# EAGLE design wings20 (EAGLE 5.01)
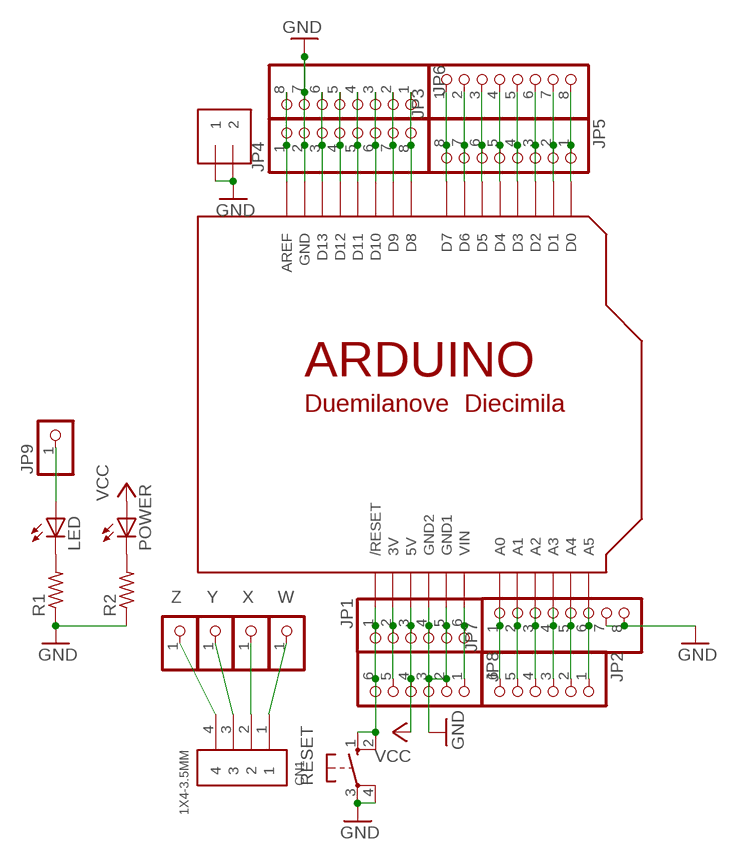
[diagram p0: schematic, sheet 1]

## Parts
CN1  1X4-3.5MM  [1X04-3.5MM]
J1  1X2-3.5MM  [1X2-3.5MM]
JP1  PINHD-1X6-3.5MM  [1X06-3.5MM]
JP2  PINHD-1X6CB  [1X06-CLEANBIG]
JP3  PINHD-1X8CLEANBIG  [1X08-CLEANBIG]
JP4  PINHD-1X8CLEANBIG  [1X08-CLEANBIG]
JP5  PINHD-1X8-3.5MM  [1X08-3.5MM]
JP6  PINHD-1X8-3.5MM  [1X08-3.5MM]
JP7  PINHD-1X8-3.5MM  [1X08-3.5MM]
JP8  PINHD-1X6CB  [1X06-CLEANBIG]
JP9  PINHD-1X1  [1X01]
LED  LED3MM  [LED3MM]
POWER  LED3MM  [LED3MM]
R1  R-US_0207/10  [0207/10]
R2  R-US_0207/10  [0207/10]
RESET  10-XX  [B3F-10XX]
U$1  ARDUINO-BPLACE  [ARDUINO-BPLACE]
W  PINHD-1X1  [1X01]
X  PINHD-1X1  [1X01]
Y  PINHD-1X1  [1X01]
Z  PINHD-1X1  [1X01]

## Nets
3V: JP1.2 JP8.5 U$1.3V
GND: J1.1 J1.2 JP1.4 JP1.5 JP4.2 JP6.7 JP7.7 JP7.8 JP8.2 JP8.3 R1.1 R2.1 RESET.3(P) RESET.4(P1) U$1.GND U$1.GND1 U$1.GND2
N$1: JP3.1 JP5.8 U$1.D7
N$2: JP3.2 JP5.7 U$1.D6
N$3: JP3.3 JP5.6 U$1.D5
N$4: JP3.4 JP5.5 U$1.D4
N$5: JP3.5 JP5.4 U$1.D3
N$6: JP3.6 JP5.3 U$1.D2
N$7: JP3.7 JP5.2 U$1.D1
N$8: JP3.8 JP5.1 U$1.D0
N$9: JP4.1 JP6.8 U$1.AREF
N$10: LED.K(C) R1.2
N$11: JP4.3 JP6.6 U$1.D13
N$12: JP4.4 JP6.5 U$1.D12
N$13: JP4.5 JP6.4 U$1.D11
N$14: JP4.6 JP6.3 U$1.D10
N$15: JP4.7 JP6.2 U$1.D9
N$16: JP4.8 JP6.1 U$1.D8
N$17: JP2.1 JP7.6 U$1.A5
N$18: JP2.2 JP7.5 U$1.A4
N$19: JP2.3 JP7.4 U$1.A3
N$20: JP2.4 JP7.3 U$1.A2
N$21: JP2.5 JP7.2 U$1.A1
N$22: JP2.6 JP7.1 U$1.A0
N$26: POWER.K(C) R2.2
N$27: JP9.1 LED.A
N$29: CN1.4 Z.1
N$30: JP1.1 JP8.6 RESET.1(S) RESET.2(S1) U$1.RESET(/RESET)
N$33: CN1.3 Y.1
N$34: CN1.2 X.1
N$35: CN1.1 W.1
VCC: JP1.3 JP8.4 POWER.A U$1.5V
VIN: JP1.6 JP8.1 U$1.VIN

## Library data of the parts
CN1 = adafruit:1X4: 4-pin connector
J1 = adafruit:1X2: 3.5mm Terminal block http://www.ladyada.net/library/pcb/eaglelibrary.html
JP1 JP2 JP8 = adafruit:PINHD-1X6: PIN HEADER
JP3-JP7 = adafruit:PINHD-1X8: PIN HEADER
JP9 W X Y Z = adafruit:PINHD-1X1: Pin header 1x1 for 0.1" spacing With round pins
LED POWER = adafruit:LED: LED OSRAM: - CHIPLED LG R971, LG N971, LY N971, LG Q971, LY Q971, LO R971, LY R971 LH N974, LH R974 LS Q976, LO Q976, LY Q976 LO Q996 - Hyper CHIPLED LW Q18S LB Q993, LB Q99A, LB R99A - SideLED LS A670, LO A670, LY A670, LG A670, LP A670 LB A673, LV A673, LT A673, LW A673 LH A674 LY A675 LS A676, LA A676, LO A676, LY A676, LW A676 LS A679, LY A679, LG A679 - Hyper Micro SIDELED® LS Y876, LA Y876, LO Y876, LY Y876 LT Y87S - SmartLED LW L88C, LW L88S LB L89C, LB L89S, LG L890 LS L89K, LO L89K, LY L89K LS L896, LA L896, LO L896, LY L896 - TOPLED LS T670, LO T670, LY T670, LG T670, LP T670 LSG T670, LSP T670, LSY T670, LOP T670, LYG T670 LG T671, LOG T671, LSG T671 LB T673, LV T673, LT T673, LW T673 LH T674 LS T676, LA T676, LO T676, LY T676, LB T676, LH T676, LSB T676, LW T676 LB T67C, LV T67C, LT T67C, LS T67K, LO T67K, LY T67K, LW E67C LS E67B, LA E67B, LO E67B, LY E67B, LB E67C, LV E67C, LT E67C LW T67C LS T679, LY T679, LG T679 LS T770, LO T770, LY T770, LG T770, LP T770 LB T773, LV T773, LT T773, LW T773 LH T774 LS E675, LA E675, LY E675, LS T675 LS T776, LA T776, LO T776, LY T776, LB T776 LHGB T686 LT T68C, LB T68C - Hyper Mini TOPLED® LB M676 - Mini TOPLED Santana® LG M470 LS M47K, LO M47K, LY M47K Source: http://www.osram.convergy.de/
R1 R2 = adafruit:R-US_: RESISTOR, American symbol
RESET = switch-omron:10-XX: OMRON SWITCH
U$1 = adafruit:ARDUINO: Arduino Diecimila/Duemilanove Make a shield with ease, this package has all the named pins as well as the two mounting drill holes and an outline of the USB and DC power connector. The outline is on the DIMENSION layer, so if your board house uses it they will cut the outline to match. http://www.ladyada.net/library/pcb/eaglelibrary.html

## Board
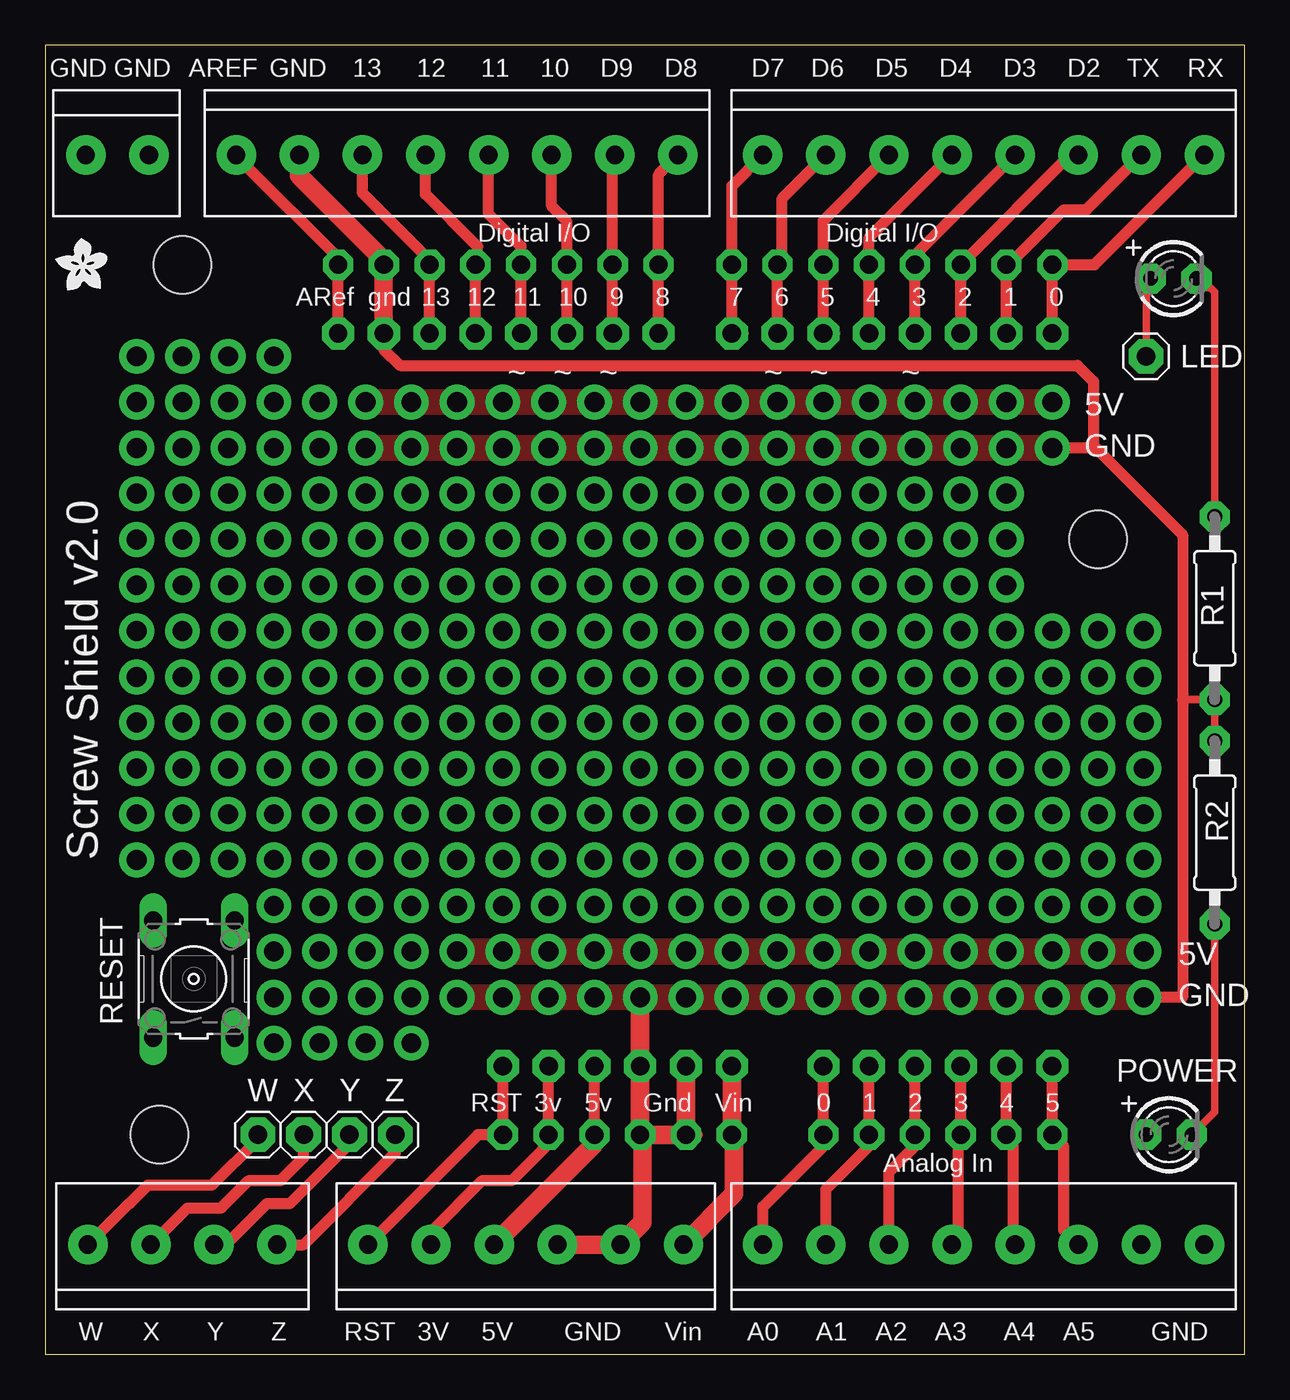
[diagram p1: board, top side]
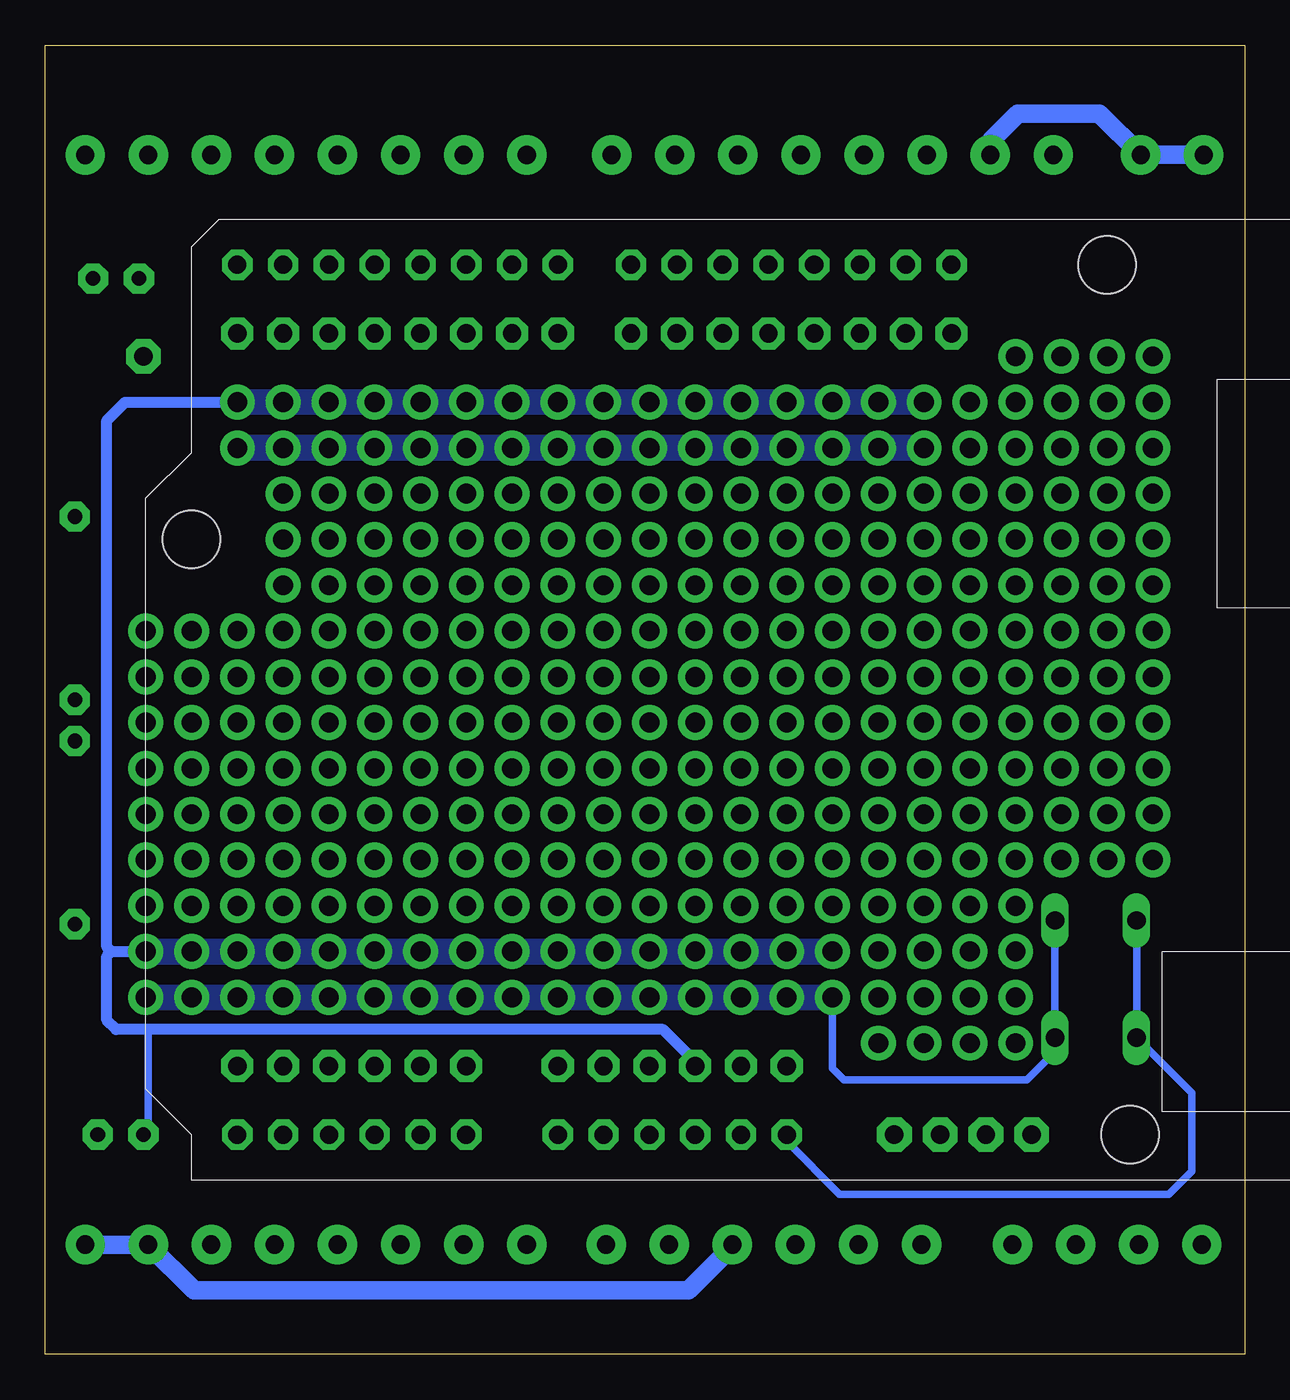
[diagram p2: board, bottom side, seen from below]

Size 66.55 x 72.64 mm. Coordinates in mm from the lower left corner, seen from the top.
Outline: 0,0 66.55,0 66.55,72.64 0,72.64 0,0
Copper layers (1*16): Top 0.035mm / dielectric 1.5mm / Bottom 0.035mm
Design rules "default *": minimum track width 16mil, minimum drill 24mil, track to track 12mil, track to pad 12mil, pad to pad 12mil, via to via 12mil, smd to smd 12mil, copper to edge 20mil, drill to drill 8mil, minimum pad ring 10mil, minimum via ring 8mil, stop-mask expansion 4mil, vias tented up to drill 0mil, thermal gap 10mil

### Footprints (pad centres in the part's own frame; a part is rotated, then mirrored left to right if it is on the bottom)
1X04-3.5MM = drill 1 pad 2.184 round: 1 -5.25,0; 2 -1.75,0; 3 1.75,0; 4 5.25,0
1X2-3.5MM = drill 1 pad 2.184 round: 1 1.8,0; 2 -1.7,0
1X06-3.5MM = drill 1 pad 2.184 round: 1 -8.75,0; 2 -5.25,0; 3 -1.75,0; 4 1.75,0; 5 5.25,0; 6 8.75,0
1X06-CLEANBIG = drill 1.016 pad 1.778 octagon: 1 -6.35,0; 2 -3.81,0; 3 -1.27,0; 4 1.27,0; 5 3.81,0; 6 6.35,0
1X08-CLEANBIG = drill 1.016 pad 1.778 octagon: 1 -8.89,0; 2 -6.35,0; 3 -3.81,0; 4 -1.27,0; 5 1.27,0; 6 3.81,0; 7 6.35,0; 8 8.89,0
1X08-3.5MM = drill 1 pad 2.184 round: 1 -12.25,0; 2 -8.75,0; 3 -5.25,0; 4 -1.75,0; 5 1.75,0; 6 5.25,0; 7 8.75,0; 8 12.25,0
1X01 = drill 1.016 pad 1.93 octagon: 1 0,0
LED3MM = drill 0.813 pad 1.676 octagon: A -1.27,0; K 1.27,0
0207/10 = drill 0.813 pad 1.676 octagon: 1 -5.08,0; 2 5.08,0
B3F-10XX = drill 1.016 long: 1 -3.251,2.261; 2 3.251,2.261; 3 -3.251,-2.261; 4 3.251,-2.261
ARDUINO-BPLACE = drill 1 pad 1.676 octagon: 3V 35.56,2.54; 5V 38.1,2.54; A0 50.8,2.54; A1 53.34,2.54; A2 55.88,2.54; A3 58.42,2.54; A4 60.96,2.54; A5 63.5,2.54; AREF 23.876,50.8; D0 63.5,50.8; D1 60.96,50.8; D2 58.42,50.8; D3 55.88,50.8; D4 53.34,50.8; D5 50.8,50.8; D6 48.26,50.8; D7 45.72,50.8; D8 41.656,50.8; D9 39.116,50.8; D10 36.576,50.8; D11 34.036,50.8; D12 31.496,50.8; D13 28.956,50.8; GND 26.416,50.8; GND1 43.18,2.54; GND2 40.64,2.54; RESET 33.02,2.54; VIN 45.72,2.54 | hole 3.2: 15.24,50.8; 66.04,35.56; 13.97,2.54

### Placement (x,y rotation side)
CN1  7.62,6.1 0 top
J1  4.06,66.55 180 top
JP1  26.67,6.1 0 top
JP2  49.53,16 180 top
JP3  46.99,56.64 0 top
JP4  25.15,56.64 0 top
JP5  52.07,66.55 180 top
JP6  22.86,66.55 180 top
JP7  52.07,6.1 0 top
JP8  31.75,16 180 top
JP9  61.09,55.37 0 top
LED  62.61,59.69 0 top
POWER  62.36,12.19 0 top
R1  64.9,41.4 90 top
R2  64.9,28.96 270 top
RESET  8.25,20.83 90 top
U$1  -7.62,9.65 0 top
U$2  [ADAFRUIT200MIL]  1.91,60.45 0 top
W  11.81,12.19 0 top
X  14.35,12.19 0 top
Y  16.89,12.19 0 top
Z  19.43,12.19 0 top

### Tracks (layer width: path | path; a pad name or v marks a point on that pad's centre or on a via)
3V
  Top 0.61: 21.46,6.05 21.46,5.84 | JP1.2 21.46,6.05 | 21.46,6.05 21.46,6.86 24.26,9.65 25.91,9.65 27.94,11.68 U$1.3V JP8.5
GND  (via drill 1.1 pad 1.93)
  Top 0.406: R2.1 R1.1 63.12,36.32
  Top 0.61: 33.15,12.19 U$1.GND2 | v35.56,19.81 35.81,19.81 | v60.96,19.81 63.12,19.81 63.12,36.32 63.12,45.47 58.29,50.29 58.17,50.29 | U$1.GND1 36.2,12.19 | JP6.7 14.1,66.55 | 31.92,5.84 31.88,5.84 | JP1.5 31.92,5.84 | 31.92,5.84 32.13,5.84 | JP4.2 18.8,55.75 19.68,54.86 57.28,54.86 58.17,53.98 58.17,50.29 | 58.17,50.29 v55.88,50.29
  Top 1.016: JP1.4 JP1.5 33.15,7.32 33.15,12.19 U$1.GND1 JP8.2 | U$1.GND2 JP8.3 v33.02,19.81 | JP6.7 14.11,65.39 18.8,60.71 U$1.GND JP4.2
  Bottom 0.406: 22.61,19.81 v22.86,19.81 22.86,15.88 22.22,15.24 12.06,15.24 10.52,16.79 RESET.3 10.52,23.6 10.67,23.75 10.67,23.93 RESET.4
  Bottom 0.61: J1.2 5.76,66.34 5.72,66.29 5.46,66.55
  Bottom 1.016: J1.1 5.46,66.55 | J1.2 8.05,68.83 12.57,68.83 14.1,67.31 14.1,66.56 JP6.7 | 64.39,6.1 JP7.8 JP7.7 58.28,3.56 30.86,3.56 28.57,5.84 28.57,5.94 JP1.4
  other vias: 17.78,50.29 20.32,50.29 22.86,50.29 25.4,50.29 27.94,50.29 30.48,50.29 33.02,50.29 35.56,50.29 38.1,50.29 40.64,50.29 43.18,50.29 45.72,50.29 48.26,50.29 50.8,50.29 53.34,50.29 25.4,19.81 27.94,19.81 30.48,19.81 38.1,19.81 40.64,19.81 43.18,19.81 45.72,19.81 48.26,19.81 50.8,19.81 53.34,19.81 55.88,19.81 58.42,19.81
  pour Top: 17.78,50.8 56.39,50.8 56.39,49.78 17.78,49.78
  pour Bottom: 56.13,50.8 17.78,50.8 17.78,49.78 56.13,49.78
  pour Bottom: 61.21,20.32 22.86,20.32 22.86,19.3 61.21,19.3
  pour Top: 22.86,20.32 61.47,20.32 61.47,19.3 22.86,19.3
N$1
  Top 0.61: 38.73,56.64 JP3.1 U$1.D7 38.1,64.83 JP5.8
N$2
  Top 0.61: JP5.7 40.89,64.12 40.89,60.71 U$1.D6 JP3.2
N$3
  Top 0.61: 43.82,56.64 JP3.3 U$1.D5 43.18,62.91 JP5.6
N$4
  Top 0.61: JP3.4 U$1.D4 45.72,61.95 JP5.5
N$5
  Top 0.61: JP3.5 U$1.D3 48.26,60.99 JP5.4
N$6
  Top 0.61: 51.18,60.2 51.18,60.41 50.72,60.41 50.67,60.45 U$1.D2 | JP3.6 U$1.D2 | U$1.D2 50.67,60.33 | JP5.3 56.9,66.55 U$1.D2
N$7
  Top 0.61: JP5.2 57.77,63.5 56.52,63.5 53.47,60.45 | JP3.7 U$1.D1 53.47,60.45 | 53.47,60.45 53.72,60.2
N$8
  Top 0.61: JP5.1 58.22,60.45 U$1.D0 JP3.8
N$9
  Top 0.61: JP6.8 10.61,66.48 16.64,60.45 U$1.AREF JP4.1
N$10
  Top 0.406: LED.K 64.39,59.18 64.64,59.18 64.9,58.93 R1.2
N$11
  Top 0.61: JP4.3 U$1.D13 21.34,60.71 17.61,64.43 JP6.6
N$12
  Top 0.61: JP6.5 21.11,64.36 24,61.47 24,60.45 U$1.D12 JP4.4
N$13
  Top 0.61: JP4.5 U$1.D11 26.42,61.47 24.61,63.27 JP6.4
N$14
  Top 0.61: JP6.3 28.11,63.71 28.96,62.87 U$1.D10 JP4.6
N$15
  Top 0.61: JP4.7 U$1.D9 31.5,66.43 JP6.2
N$16
  Top 0.61: JP4.8 U$1.D8 34.04,65.47 JP6.1
N$17
  Top 0.61: JP7.6 56.52,6.9 56.52,11.56 U$1.A5 JP2.1
N$18
  Top 0.61: JP7.5 53.72,6 53.72,11.81 U$1.A4 JP2.2
N$19
  Top 0.61: JP7.4 50.67,6.45 50.67,12.06 U$1.A3 JP2.3
N$20
  Top 0.61: JP7.3 46.82,10.12 48.26,11.56 U$1.A2 JP2.4
N$21
  Top 0.61: JP7.2 43.32,9.16 45.72,11.56 U$1.A1 JP2.5
N$22
  Top 0.61: JP7.1 39.82,8.2 43.18,11.56 U$1.A0 JP2.6
N$23  (via drill 1.1 pad 1.93)
  other vias: 15.24,52.83
N$24  (via drill 1.1 pad 1.93)
  other vias: 12.7,55.37
N$26
  Top 0.406: POWER.K 64.9,13.46 R2.2
N$27
  Top 0.406: LED.A 61.09,59.44 JP9.1
N$28  (via drill 1.1 pad 1.93)
  other vias: 10.16,55.37
N$29
  Top 0.61: CN1.4 14.35,6.1 19.43,11.18 Z.1 19.68,12.45
N$30
  Top 0.61: JP8.6 U$1.RESET 24.02,12.19 JP1.1
  Bottom 0.406: RESET.2 5.97,24.05 5.97,17.55 RESET.1 2.92,14.5 2.92,10.16 4.19,8.89 22.48,8.89 25.4,11.81 U$1.RESET 25.78,12.19
N$31  (via drill 1.1 pad 1.93)
  other vias: 7.62,55.37
N$32  (via drill 1.1 pad 1.93)
  other vias: 5.08,55.37
N$33
  Top 0.61: CN1.3 10.03,6.1 12.32,8.38 13.59,8.38 16.89,11.68 Y.1
N$34
  Top 0.61: CN1.2 7.9,8.13 9.78,8.13 11.3,9.65 13.08,9.65 14.35,10.92 X.1
N$35
  Top 0.61: CN1.1 4.66,8.38 4.7,8.38 5.72,9.4 9.27,9.4 11.81,11.94 W.1
N$46  (via drill 1.1 pad 1.93)
  other vias: 15.24,50.29
N$49  (via drill 1.1 pad 1.93)
  other vias: 17.78,47.75
N$50  (via drill 1.1 pad 1.93)
  other vias: 15.24,47.75
N$51  (via drill 1.1 pad 1.93)
  other vias: 20.32,47.75
N$52  (via drill 1.1 pad 1.93)
  other vias: 22.86,47.75
N$55  (via drill 1.1 pad 1.93)
  other vias: 25.4,47.75
N$56  (via drill 1.1 pad 1.93)
  other vias: 27.94,47.75
N$59  (via drill 1.1 pad 1.93)
  other vias: 30.48,47.75
N$60  (via drill 1.1 pad 1.93)
  other vias: 33.02,47.75
N$63  (via drill 1.1 pad 1.93)
  other vias: 35.56,47.75
N$64  (via drill 1.1 pad 1.93)
  other vias: 38.1,47.75
N$67  (via drill 1.1 pad 1.93)
  other vias: 40.64,47.75
N$68  (via drill 1.1 pad 1.93)
  other vias: 43.18,47.75
N$71  (via drill 1.1 pad 1.93)
  other vias: 48.26,47.75
N$73  (via drill 1.1 pad 1.93)
  other vias: 45.72,47.75
N$74  (via drill 1.1 pad 1.93)
  other vias: 50.8,47.75
N$77  (via drill 1.1 pad 1.93)
  other vias: 53.34,47.75
N$82  (via drill 1.1 pad 1.93)
  other vias: 55.88,40.13
N$83  (via drill 1.1 pad 1.93)
  other vias: 55.88,37.59
N$84  (via drill 1.1 pad 1.93)
  other vias: 55.88,35.05
N$85  (via drill 1.1 pad 1.93)
  other vias: 55.88,32.51
N$86  (via drill 1.1 pad 1.93)
  other vias: 55.88,29.97
N$87  (via drill 1.1 pad 1.93)
  other vias: 55.88,27.43
N$88  (via drill 1.1 pad 1.93)
  other vias: 55.88,24.89
N$91  (via drill 1.1 pad 1.93)
  other vias: 12.7,52.83
N$92  (via drill 1.1 pad 1.93)
  other vias: 12.7,47.75
N$93  (via drill 1.1 pad 1.93)
  other vias: 53.34,24.89
N$94  (via drill 1.1 pad 1.93)
  other vias: 53.34,27.43
N$95  (via drill 1.1 pad 1.93)
  other vias: 53.34,29.97
N$96  (via drill 1.1 pad 1.93)
  other vias: 53.34,32.51
N$97  (via drill 1.1 pad 1.93)
  other vias: 53.34,35.05
N$98  (via drill 1.1 pad 1.93)
  other vias: 53.34,37.59
N$99  (via drill 1.1 pad 1.93)
  other vias: 53.34,40.13
N$100  (via drill 1.1 pad 1.93)
  other vias: 53.34,42.67
N$101  (via drill 1.1 pad 1.93)
  other vias: 53.34,45.21
N$102  (via drill 1.1 pad 1.93)
  other vias: 50.8,45.21
N$103  (via drill 1.1 pad 1.93)
  other vias: 50.8,42.67
N$104  (via drill 1.1 pad 1.93)
  other vias: 50.8,40.13
N$105  (via drill 1.1 pad 1.93)
  other vias: 50.8,35.05
N$106  (via drill 1.1 pad 1.93)
  other vias: 50.8,37.59
N$107  (via drill 1.1 pad 1.93)
  other vias: 50.8,32.51
N$108  (via drill 1.1 pad 1.93)
  other vias: 50.8,29.97
N$109  (via drill 1.1 pad 1.93)
  other vias: 50.8,27.43
N$110  (via drill 1.1 pad 1.93)
  other vias: 50.8,24.89
N$113  (via drill 1.1 pad 1.93)
  other vias: 45.72,24.89
N$114  (via drill 1.1 pad 1.93)
  other vias: 48.26,24.89
N$115  (via drill 1.1 pad 1.93)
  other vias: 48.26,27.43
N$116  (via drill 1.1 pad 1.93)
  other vias: 45.72,27.43
N$117  (via drill 1.1 pad 1.93)
  other vias: 45.72,29.97
N$118  (via drill 1.1 pad 1.93)
  other vias: 48.26,29.97
N$119  (via drill 1.1 pad 1.93)
  other vias: 48.26,32.51
N$120  (via drill 1.1 pad 1.93)
  other vias: 45.72,32.51
N$121  (via drill 1.1 pad 1.93)
  other vias: 45.72,35.05
N$122  (via drill 1.1 pad 1.93)
  other vias: 48.26,35.05
N$123  (via drill 1.1 pad 1.93)
  other vias: 48.26,37.59
N$124  (via drill 1.1 pad 1.93)
  other vias: 45.72,37.59
N$125  (via drill 1.1 pad 1.93)
  other vias: 45.72,40.13
N$126  (via drill 1.1 pad 1.93)
  other vias: 48.26,40.13
N$127  (via drill 1.1 pad 1.93)
  other vias: 48.26,42.67
N$128  (via drill 1.1 pad 1.93)
  other vias: 45.72,42.67
N$129  (via drill 1.1 pad 1.93)
  other vias: 45.72,45.21
N$130  (via drill 1.1 pad 1.93)
  other vias: 48.26,45.21
N$131  (via drill 1.1 pad 1.93)
  other vias: 43.18,45.21
N$132  (via drill 1.1 pad 1.93)
  other vias: 43.18,40.13
N$133  (via drill 1.1 pad 1.93)
  other vias: 43.18,42.67
N$134  (via drill 1.1 pad 1.93)
  other vias: 43.18,37.59
N$135  (via drill 1.1 pad 1.93)
  other vias: 43.18,35.05
N$136  (via drill 1.1 pad 1.93)
  other vias: 43.18,32.51
N$137  (via drill 1.1 pad 1.93)
  other vias: 43.18,29.97
N$138  (via drill 1.1 pad 1.93)
  other vias: 43.18,27.43
N$139  (via drill 1.1 pad 1.93)
  other vias: 43.18,24.89
N$142  (via drill 1.1 pad 1.93)
  other vias: 40.64,42.67
N$143  (via drill 1.1 pad 1.93)
  other vias: 40.64,45.21
N$144  (via drill 1.1 pad 1.93)
  other vias: 40.64,40.13
N$145  (via drill 1.1 pad 1.93)
  other vias: 40.64,37.59
N$146  (via drill 1.1 pad 1.93)
  other vias: 40.64,35.05
N$147  (via drill 1.1 pad 1.93)
  other vias: 40.64,32.51
N$148  (via drill 1.1 pad 1.93)
  other vias: 40.64,29.97
N$149  (via drill 1.1 pad 1.93)
  other vias: 40.64,27.43
N$150  (via drill 1.1 pad 1.93)
  other vias: 40.64,24.89
N$153  (via drill 1.1 pad 1.93)
  other vias: 38.1,24.89
N$154  (via drill 1.1 pad 1.93)
  other vias: 38.1,27.43
N$155  (via drill 1.1 pad 1.93)
  other vias: 38.1,29.97
N$156  (via drill 1.1 pad 1.93)
  other vias: 38.1,32.51
N$157  (via drill 1.1 pad 1.93)
  other vias: 38.1,35.05
N$158  (via drill 1.1 pad 1.93)
  other vias: 38.1,37.59
N$159  (via drill 1.1 pad 1.93)
  other vias: 38.1,40.13
N$160  (via drill 1.1 pad 1.93)
  other vias: 38.1,42.67
N$161  (via drill 1.1 pad 1.93)
  other vias: 38.1,45.21
N$162  (via drill 1.1 pad 1.93)
  other vias: 35.56,45.21
N$163  (via drill 1.1 pad 1.93)
  other vias: 35.56,42.67
N$164  (via drill 1.1 pad 1.93)
  other vias: 35.56,40.13
N$165  (via drill 1.1 pad 1.93)
  other vias: 35.56,37.59
N$166  (via drill 1.1 pad 1.93)
  other vias: 35.56,35.05
N$167  (via drill 1.1 pad 1.93)
  other vias: 35.56,32.51
N$168  (via drill 1.1 pad 1.93)
  other vias: 35.56,29.97
N$169  (via drill 1.1 pad 1.93)
  other vias: 35.56,27.43
N$170  (via drill 1.1 pad 1.93)
  other vias: 35.56,24.89
N$173  (via drill 1.1 pad 1.93)
  other vias: 30.48,24.89
N$174  (via drill 1.1 pad 1.93)
  other vias: 33.02,24.89
N$175  (via drill 1.1 pad 1.93)
  other vias: 33.02,27.43
N$176  (via drill 1.1 pad 1.93)
  other vias: 30.48,27.43
N$177  (via drill 1.1 pad 1.93)
  other vias: 30.48,29.97
N$178  (via drill 1.1 pad 1.93)
  other vias: 33.02,29.97
N$179  (via drill 1.1 pad 1.93)
  other vias: 33.02,32.51
N$180  (via drill 1.1 pad 1.93)
  other vias: 30.48,35.05
N$181  (via drill 1.1 pad 1.93)
  other vias: 30.48,37.59
N$182  (via drill 1.1 pad 1.93)
  other vias: 33.02,40.13
N$183  (via drill 1.1 pad 1.93)
  other vias: 30.48,40.13
N$184  (via drill 1.1 pad 1.93)
  other vias: 30.48,42.67
N$185  (via drill 1.1 pad 1.93)
  other vias: 33.02,45.21
N$186  (via drill 1.1 pad 1.93)
  other vias: 30.48,45.21
N$187  (via drill 1.1 pad 1.93)
  other vias: 33.02,42.67
N$188  (via drill 1.1 pad 1.93)
  other vias: 33.02,37.59
N$189  (via drill 1.1 pad 1.93)
  other vias: 30.48,32.51
N$190  (via drill 1.1 pad 1.93)
  other vias: 33.02,35.05
N$193  (via drill 1.1 pad 1.93)
  other vias: 27.94,24.89
N$194  (via drill 1.1 pad 1.93)
  other vias: 27.94,27.43
N$195  (via drill 1.1 pad 1.93)
  other vias: 27.94,45.21
N$196  (via drill 1.1 pad 1.93)
  other vias: 27.94,42.67
N$197  (via drill 1.1 pad 1.93)
  other vias: 27.94,40.13
N$198  (via drill 1.1 pad 1.93)
  other vias: 27.94,37.59
N$199  (via drill 1.1 pad 1.93)
  other vias: 27.94,35.05
N$200  (via drill 1.1 pad 1.93)
  other vias: 27.94,29.97
N$201  (via drill 1.1 pad 1.93)
  other vias: 27.94,32.51
N$202  (via drill 1.1 pad 1.93)
  other vias: 25.4,32.51
N$203  (via drill 1.1 pad 1.93)
  other vias: 25.4,45.21
N$204  (via drill 1.1 pad 1.93)
  other vias: 25.4,40.13
N$205  (via drill 1.1 pad 1.93)
  other vias: 25.4,42.67
N$206  (via drill 1.1 pad 1.93)
  other vias: 25.4,37.59
N$207  (via drill 1.1 pad 1.93)
  other vias: 25.4,35.05
N$208  (via drill 1.1 pad 1.93)
  other vias: 25.4,29.97
N$209  (via drill 1.1 pad 1.93)
  other vias: 25.4,27.43
N$210  (via drill 1.1 pad 1.93)
  other vias: 25.4,24.89
N$213  (via drill 1.1 pad 1.93)
  other vias: 22.86,24.89
N$214  (via drill 1.1 pad 1.93)
  other vias: 22.86,27.43
N$215  (via drill 1.1 pad 1.93)
  other vias: 22.86,29.97
N$216  (via drill 1.1 pad 1.93)
  other vias: 22.86,32.51
N$217  (via drill 1.1 pad 1.93)
  other vias: 22.86,37.59
N$218  (via drill 1.1 pad 1.93)
  other vias: 22.86,40.13
N$219  (via drill 1.1 pad 1.93)
  other vias: 22.86,42.67
N$220  (via drill 1.1 pad 1.93)
  other vias: 22.86,45.21
N$221  (via drill 1.1 pad 1.93)
  other vias: 22.86,35.05
N$222  (via drill 1.1 pad 1.93)
  other vias: 20.32,42.67
N$223  (via drill 1.1 pad 1.93)
  other vias: 20.32,45.21
N$224  (via drill 1.1 pad 1.93)
  other vias: 20.32,40.13
N$225  (via drill 1.1 pad 1.93)
  other vias: 20.32,37.59
N$226  (via drill 1.1 pad 1.93)
  other vias: 20.32,35.05
N$227  (via drill 1.1 pad 1.93)
  other vias: 20.32,32.51
N$228  (via drill 1.1 pad 1.93)
  other vias: 20.32,29.97
N$229  (via drill 1.1 pad 1.93)
  other vias: 20.32,27.43
N$230  (via drill 1.1 pad 1.93)
  other vias: 20.32,24.89
N$231  (via drill 1.1 pad 1.93)
  other vias: 20.32,22.35
N$232  (via drill 1.1 pad 1.93)
  other vias: 17.78,22.35
N$233  (via drill 1.1 pad 1.93)
  other vias: 17.78,24.89
N$234  (via drill 1.1 pad 1.93)
  other vias: 17.78,27.43
N$235  (via drill 1.1 pad 1.93)
  other vias: 17.78,29.97
N$236  (via drill 1.1 pad 1.93)
  other vias: 17.78,35.05
N$237  (via drill 1.1 pad 1.93)
  other vias: 17.78,37.59
N$238  (via drill 1.1 pad 1.93)
  other vias: 17.78,40.13
N$239  (via drill 1.1 pad 1.93)
  other vias: 17.78,42.67
N$240  (via drill 1.1 pad 1.93)
  other vias: 17.78,45.21
N$241  (via drill 1.1 pad 1.93)
  other vias: 17.78,32.51
N$242  (via drill 1.1 pad 1.93)
  other vias: 15.24,35.05
N$243  (via drill 1.1 pad 1.93)
  other vias: 15.24,40.13
N$244  (via drill 1.1 pad 1.93)
  other vias: 15.24,42.67
N$245  (via drill 1.1 pad 1.93)
  other vias: 15.24,45.21
N$246  (via drill 1.1 pad 1.93)
  other vias: 15.24,37.59
N$247  (via drill 1.1 pad 1.93)
  other vias: 15.24,32.51
N$248  (via drill 1.1 pad 1.93)
  other vias: 15.24,27.43
N$249  (via drill 1.1 pad 1.93)
  other vias: 15.24,29.97
N$250  (via drill 1.1 pad 1.93)
  other vias: 15.24,24.89
N$251  (via drill 1.1 pad 1.93)
  other vias: 15.24,22.35
N$252  (via drill 1.1 pad 1.93)
  other vias: 12.7,50.29
N$253  (via drill 1.1 pad 1.93)
  other vias: 12.7,45.21
N$254  (via drill 1.1 pad 1.93)
  other vias: 12.7,40.13
N$255  (via drill 1.1 pad 1.93)
  other vias: 12.7,37.59
N$256  (via drill 1.1 pad 1.93)
  other vias: 12.7,35.05
N$257  (via drill 1.1 pad 1.93)
  other vias: 12.7,42.67
N$258  (via drill 1.1 pad 1.93)
  other vias: 12.7,32.51
N$259  (via drill 1.1 pad 1.93)
  other vias: 12.7,29.97
N$260  (via drill 1.1 pad 1.93)
  other vias: 12.7,27.43
N$261  (via drill 1.1 pad 1.93)
  other vias: 12.7,24.89
N$262  (via drill 1.1 pad 1.93)
  other vias: 12.7,22.35
N$264  (via drill 1.1 pad 1.93)
  other vias: 10.16,27.43
N$266  (via drill 1.1 pad 1.93)
  other vias: 10.16,29.97
N$267  (via drill 1.1 pad 1.93)
  other vias: 10.16,32.51
N$268  (via drill 1.1 pad 1.93)
  other vias: 10.16,35.05
N$269  (via drill 1.1 pad 1.93)
  other vias: 10.16,37.59
N$270  (via drill 1.1 pad 1.93)
  other vias: 10.16,40.13
N$271  (via drill 1.1 pad 1.93)
  other vias: 10.16,42.67
N$272  (via drill 1.1 pad 1.93)
  other vias: 10.16,45.21
N$273  (via drill 1.1 pad 1.93)
  other vias: 10.16,47.75
N$274  (via drill 1.1 pad 1.93)
  other vias: 10.16,50.29
N$275  (via drill 1.1 pad 1.93)
  other vias: 10.16,52.83
N$276  (via drill 1.1 pad 1.93)
  other vias: 5.08,52.83
N$277  (via drill 1.1 pad 1.93)
  other vias: 7.62,52.83
N$280  (via drill 1.1 pad 1.93)
  other vias: 5.08,50.29
N$281  (via drill 1.1 pad 1.93)
  other vias: 7.62,50.29
N$282  (via drill 1.1 pad 1.93)
  other vias: 5.08,47.75
N$283  (via drill 1.1 pad 1.93)
  other vias: 7.62,47.75
N$284  (via drill 1.1 pad 1.93)
  other vias: 7.62,45.21
N$285  (via drill 1.1 pad 1.93)
  other vias: 5.08,45.21
N$286  (via drill 1.1 pad 1.93)
  other vias: 5.08,40.13
N$287  (via drill 1.1 pad 1.93)
  other vias: 5.08,42.67
N$288  (via drill 1.1 pad 1.93)
  other vias: 7.62,42.67
N$289  (via drill 1.1 pad 1.93)
  other vias: 7.62,40.13
N$290  (via drill 1.1 pad 1.93)
  other vias: 7.62,37.59
N$291  (via drill 1.1 pad 1.93)
  other vias: 7.62,35.05
N$292  (via drill 1.1 pad 1.93)
  other vias: 7.62,32.51
N$293  (via drill 1.1 pad 1.93)
  other vias: 7.62,29.97
N$295  (via drill 1.1 pad 1.93)
  other vias: 7.62,27.43
N$304  (via drill 1.1 pad 1.93)
  other vias: 12.7,17.27
N$305  (via drill 1.1 pad 1.93)
  other vias: 12.7,19.81
N$306  (via drill 1.1 pad 1.93)
  other vias: 15.24,19.81
N$307  (via drill 1.1 pad 1.93)
  other vias: 15.24,17.27
N$309  (via drill 1.1 pad 1.93)
  other vias: 17.78,17.27
N$310  (via drill 1.1 pad 1.93)
  other vias: 17.78,19.81
N$312  (via drill 1.1 pad 1.93)
  other vias: 5.08,37.59
N$313  (via drill 1.1 pad 1.93)
  other vias: 5.08,35.05
N$314  (via drill 1.1 pad 1.93)
  other vias: 5.08,32.51
N$315  (via drill 1.1 pad 1.93)
  other vias: 5.08,29.97
N$316  (via drill 1.1 pad 1.93)
  other vias: 5.08,27.43
N$338  (via drill 1.1 pad 1.93)
  other vias: 60.96,40.13
N$339  (via drill 1.1 pad 1.93)
  other vias: 60.96,35.05
N$345  (via drill 1.1 pad 1.93)
  other vias: 58.42,40.13
N$346  (via drill 1.1 pad 1.93)
  other vias: 58.42,37.59
N$347  (via drill 1.1 pad 1.93)
  other vias: 58.42,35.05
N$348  (via drill 1.1 pad 1.93)
  other vias: 58.42,29.97
N$349  (via drill 1.1 pad 1.93)
  other vias: 58.42,32.51
N$350  (via drill 1.1 pad 1.93)
  other vias: 58.42,27.43
N$351  (via drill 1.1 pad 1.93)
  other vias: 58.42,24.89
N$354  (via drill 1.1 pad 1.93)
  other vias: 60.96,24.89
N$355  (via drill 1.1 pad 1.93)
  other vias: 60.96,27.43
N$356  (via drill 1.1 pad 1.93)
  other vias: 60.96,29.97
N$357  (via drill 1.1 pad 1.93)
  other vias: 60.96,32.51
N$358  (via drill 1.1 pad 1.93)
  other vias: 60.96,37.59
N$365  (via drill 1.1 pad 1.93)
  other vias: 20.32,17.27
N$366  (via drill 1.1 pad 1.93)
  other vias: 20.32,19.81
VCC  (via drill 1.1 pad 1.93)
  Top 0.61: JP1.3 25.02,6.1 25.02,6.22 | U$1.5V JP8.4
  Top 1.016: 25.02,6.22 30.48,11.68 U$1.5V
  Bottom 0.406: POWER.A 60.83,12.45 60.83,18.03
  Bottom 0.61: 60.71,22.35 v60.96,22.35 62.87,22.35 | 62.87,22.35 63.12,22.1 63.12,18.54 62.61,18.03 60.83,18.03 32.26,18.03 30.48,16.26 JP8.4 | 62.87,22.35 63.12,22.61 63.12,51.82 62.1,52.83 v55.88,52.83
  other vias: 53.34,52.83 50.8,52.83 48.26,52.83 45.72,52.83 43.18,52.83 40.64,52.83 38.1,52.83 35.56,52.83 33.02,52.83 30.48,52.83 27.94,52.83 25.4,52.83 22.86,52.83 20.32,52.83 17.78,52.83 58.42,22.35 55.88,22.35 53.34,22.35 50.8,22.35 48.26,22.35 45.72,22.35 43.18,22.35 40.64,22.35 38.1,22.35 35.56,22.35 33.02,22.35 30.48,22.35 27.94,22.35 25.4,22.35 22.86,22.35
  pour Top: 17.53,53.34 55.88,53.34 55.88,52.32 17.53,52.32
  pour Bottom: 17.53,53.34 55.88,53.34 55.88,52.32 17.53,52.32
  pour Top: 22.61,22.86 60.96,22.86 60.96,21.84 22.61,21.84
  pour Bottom: 22.61,22.86 60.96,22.86 60.96,21.84 22.61,21.84
VIN
  Top 0.406: 38.23,11.56 38.1,11.68 U$1.VIN
  Top 1.016: JP1.6 38.23,8.9 38.23,11.56 | U$1.VIN JP8.1

### Text on the board
tPlace: GND | GND | AREF | GND | 13 | 12 | 11 | 10 | D9 | D8 | D7 | D6 | D5 | D4 | D3 | D2 | TX | RX | ~ | ~ | ~ | ~ | ~ | ~ | 5V | GND | Screw Shield v2.0 | 5V | GND | W | X | Y | Z | RST | 3V | 5V | GND | Vin | A0 | A1 | A2 | A3 | A4 | A5 | GND